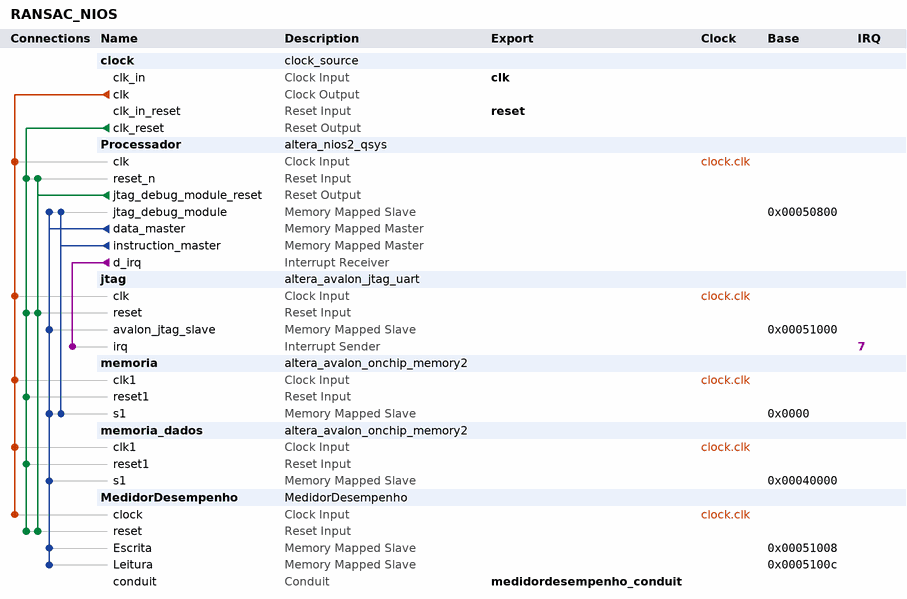
[diagram p0: system contents]
# Platform Designer (Qsys) system RANSAC_NIOS, Cyclone IV E EP4CE115F29C7
# Parameters at their usual value, and those the tool derives, are not listed.
package require -exact qsys 18.1
create_system RANSAC_NIOS
set_project_property DEVICE_FAMILY {Cyclone IV E}
set_project_property DEVICE EP4CE115F29C7

add_instance clock clock_source 18.1
set_instance_parameter_value clock clockFrequency 50000000

add_instance Processador altera_nios2_qsys 16.1
set_instance_parameter_value Processador breakSlave Processador.jtag_debug_module
set_instance_parameter_value Processador exceptionSlave memoria.s1
set_instance_parameter_value Processador icache_size 4096
set_instance_parameter_value Processador impl Tiny
set_instance_parameter_value Processador mmu_TLBMissExcSlave None
set_instance_parameter_value Processador resetSlave memoria.s1
set_instance_parameter_value Processador resetrequest_enabled true

add_instance jtag altera_avalon_jtag_uart 18.1
set_instance_parameter_value jtag simInteractiveOptions NO_INTERACTIVE_WINDOWS

add_instance memoria altera_avalon_onchip_memory2 18.1
set_instance_parameter_value memoria dataWidth 32
set_instance_parameter_value memoria dualPort false
set_instance_parameter_value memoria initMemContent true
set_instance_parameter_value memoria initializationFileName onchip_mem.hex
set_instance_parameter_value memoria memorySize 262144

add_instance memoria_dados altera_avalon_onchip_memory2 18.1
set_instance_parameter_value memoria_dados dataWidth 32
set_instance_parameter_value memoria_dados dualPort false
set_instance_parameter_value memoria_dados initMemContent true
set_instance_parameter_value memoria_dados initializationFileName C:/ti/projetos/LAB4/ransac/hardware/Quartus/RANSAC_NIOS/MemoriaDados.mif
set_instance_parameter_value memoria_dados memorySize 65536
set_instance_parameter_value memoria_dados useNonDefaultInitFile true
set_instance_parameter_value memoria_dados writable false

add_instance MedidorDesempenho MedidorDesempenho 1.0

# connections
add_connection clock.clk jtag.clk clock
add_connection clock.clk MedidorDesempenho.clock clock
add_connection clock.clk memoria.clk1 clock
add_connection clock.clk memoria_dados.clk1 clock
add_connection clock.clk Processador.clk clock
add_connection clock.clk_reset jtag.reset reset
add_connection clock.clk_reset MedidorDesempenho.reset reset
add_connection clock.clk_reset memoria.reset1 reset
add_connection clock.clk_reset memoria_dados.reset1 reset
add_connection clock.clk_reset Processador.reset_n reset
add_connection Processador.jtag_debug_module_reset jtag.reset reset
add_connection Processador.jtag_debug_module_reset MedidorDesempenho.reset reset
add_connection Processador.jtag_debug_module_reset Processador.reset_n reset
add_connection Processador.data_master jtag.avalon_jtag_slave avalon
set_connection_parameter_value Processador.data_master/jtag.avalon_jtag_slave baseAddress 0x00051000
add_connection Processador.data_master MedidorDesempenho.Escrita avalon
set_connection_parameter_value Processador.data_master/MedidorDesempenho.Escrita baseAddress 0x00051008
add_connection Processador.data_master MedidorDesempenho.Leitura avalon
set_connection_parameter_value Processador.data_master/MedidorDesempenho.Leitura baseAddress 0x0005100c
add_connection Processador.data_master memoria.s1 avalon
set_connection_parameter_value Processador.data_master/memoria.s1 baseAddress 0x0000
add_connection Processador.data_master memoria_dados.s1 avalon
set_connection_parameter_value Processador.data_master/memoria_dados.s1 baseAddress 0x00040000
add_connection Processador.data_master Processador.jtag_debug_module avalon
set_connection_parameter_value Processador.data_master/Processador.jtag_debug_module baseAddress 0x00050800
add_connection Processador.instruction_master memoria.s1 avalon
set_connection_parameter_value Processador.instruction_master/memoria.s1 baseAddress 0x0000
add_connection Processador.instruction_master Processador.jtag_debug_module avalon
set_connection_parameter_value Processador.instruction_master/Processador.jtag_debug_module baseAddress 0x00050800
add_connection Processador.d_irq jtag.irq interrupt
set_connection_parameter_value Processador.d_irq/jtag.irq irqNumber 7

# exported interfaces
add_interface clk clock sink
set_interface_property clk EXPORT_OF clock.clk_in
add_interface medidordesempenho_conduit conduit end
set_interface_property medidordesempenho_conduit EXPORT_OF MedidorDesempenho.conduit
add_interface reset reset sink
set_interface_property reset EXPORT_OF clock.clk_in_reset

set_interconnect_requirement {$system} qsys_mm.clockCrossingAdapter HANDSHAKE
set_interconnect_requirement {$system} qsys_mm.enableEccProtection FALSE
set_interconnect_requirement {$system} qsys_mm.insertDefaultSlave FALSE
set_interconnect_requirement {$system} qsys_mm.maxAdditionalLatency 1

save_system RANSAC_NIOS.qsys
